# Altium project Driver_10kW.PrjPcb
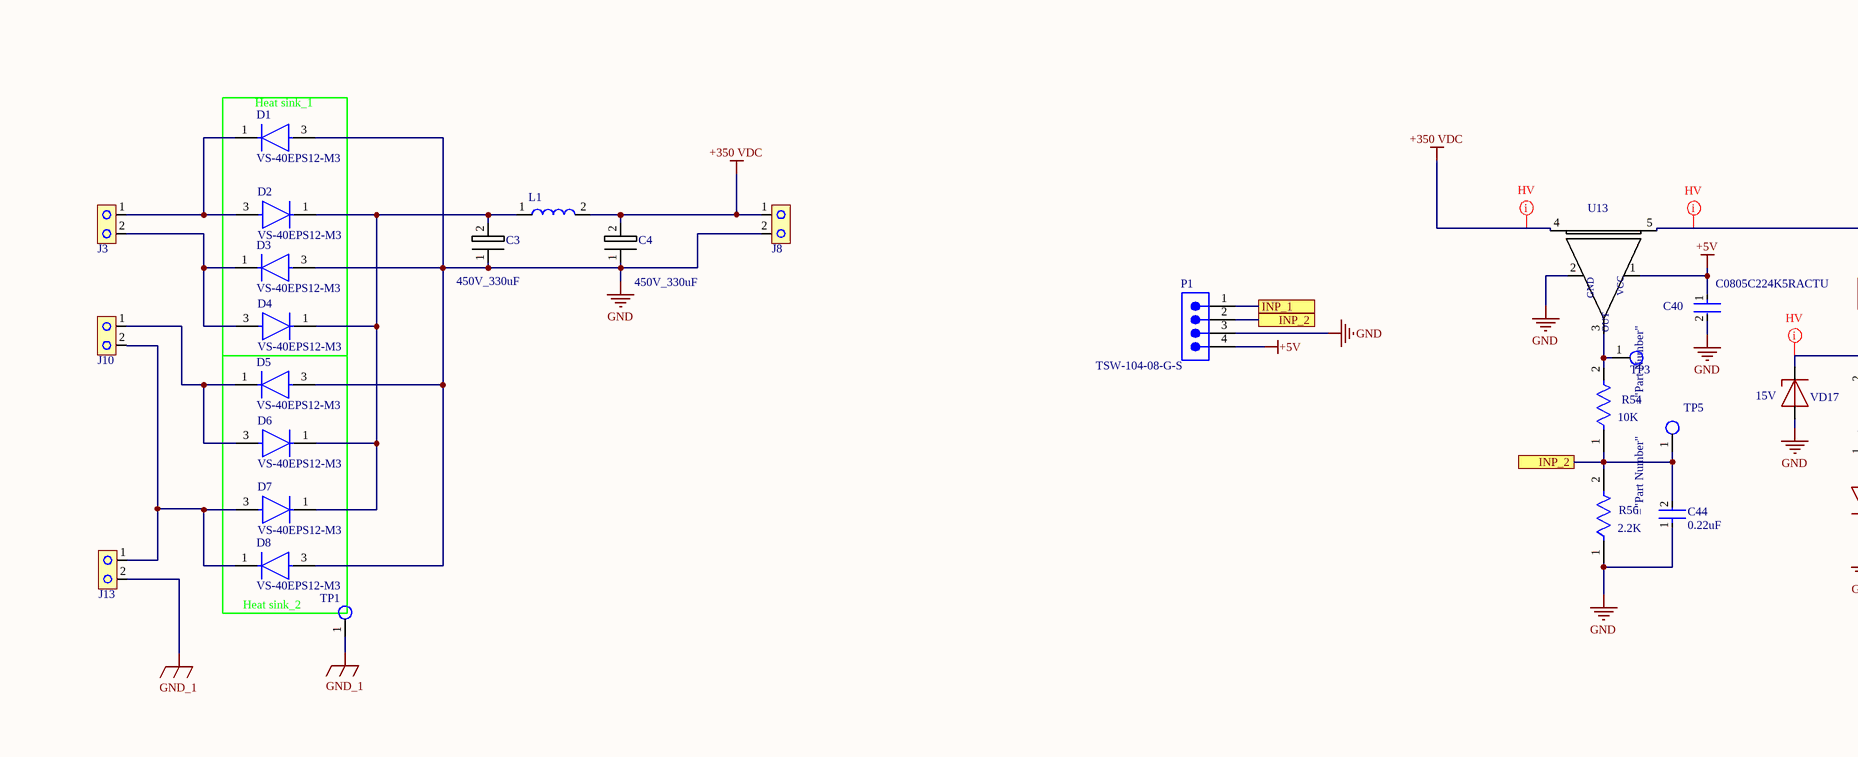
[diagram p0: Driver_10kW.SchDoc, top left]
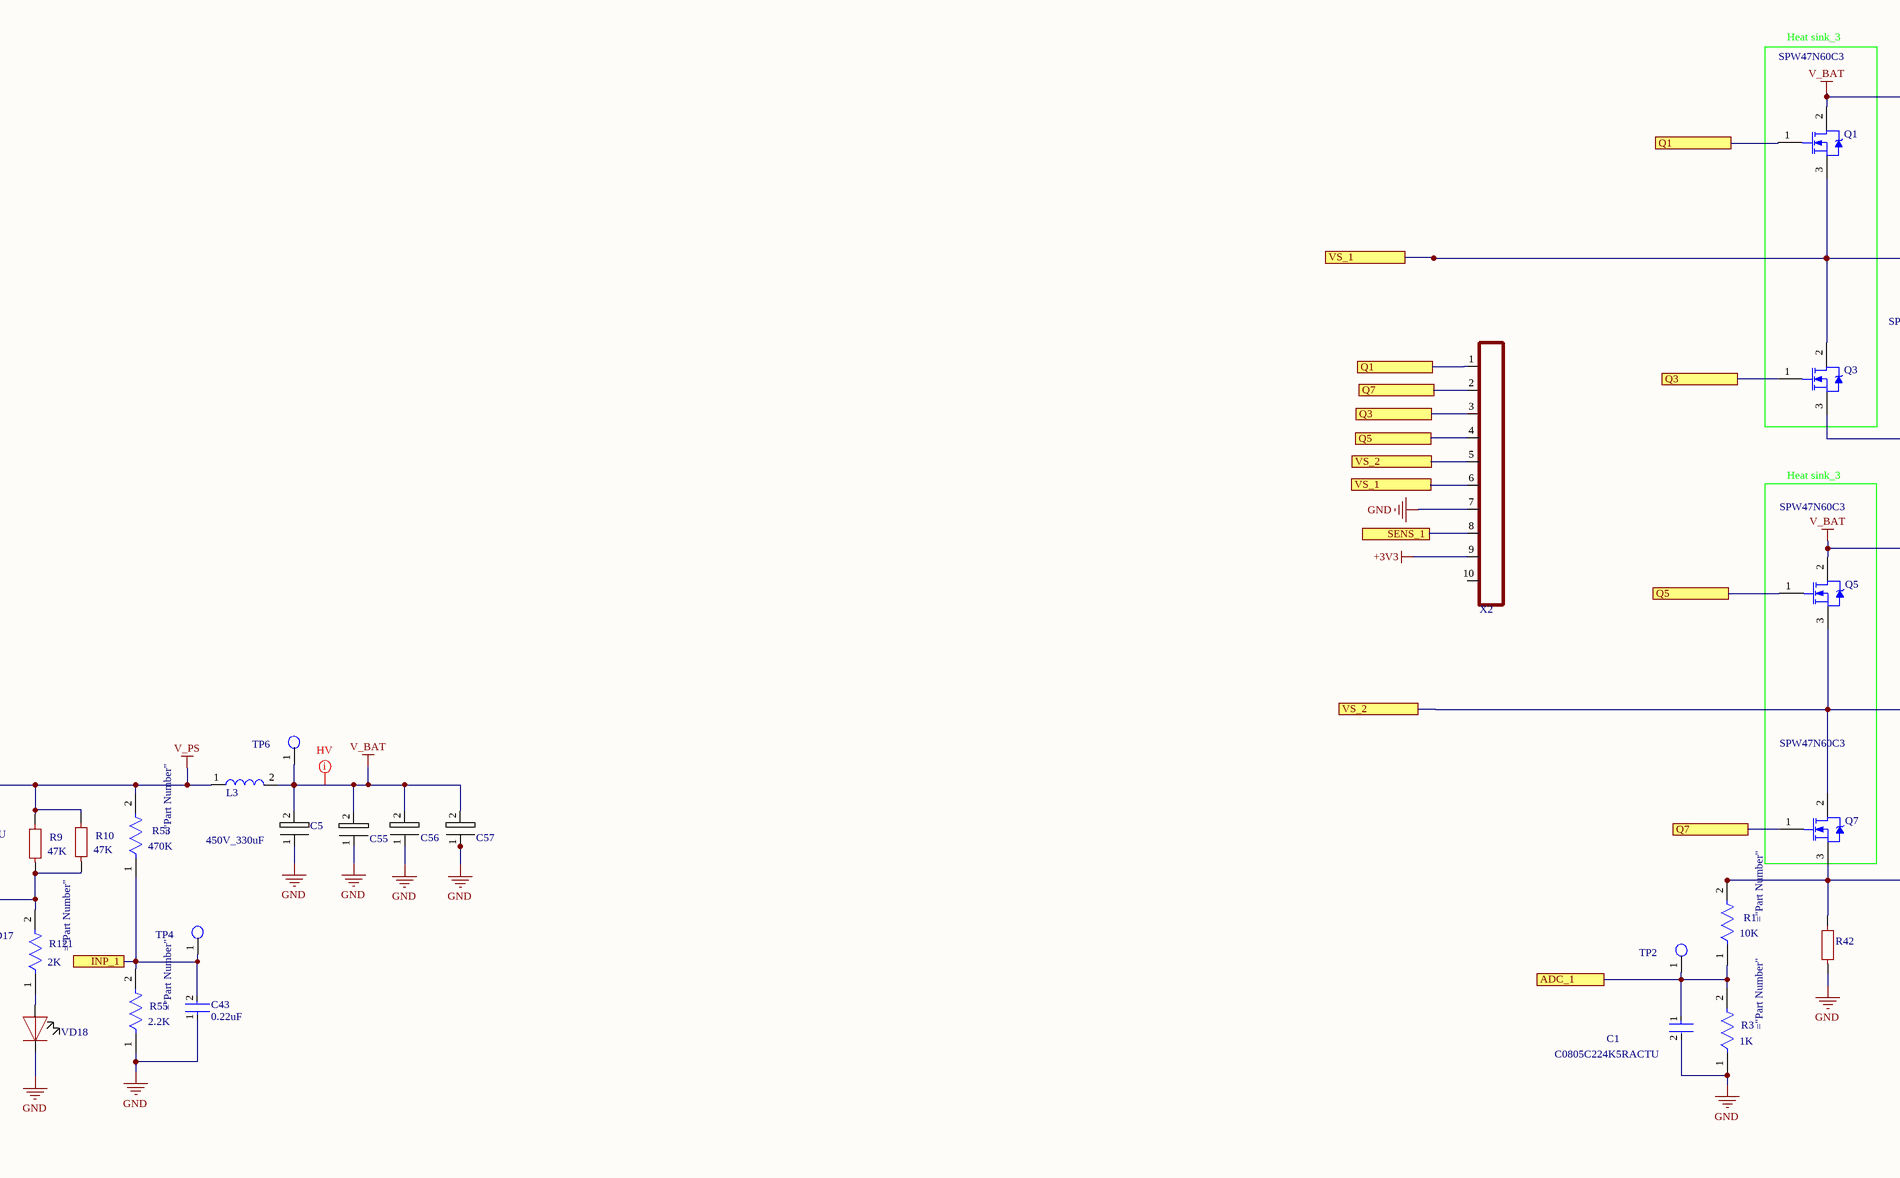
[diagram p1: Driver_10kW.SchDoc, top middle]
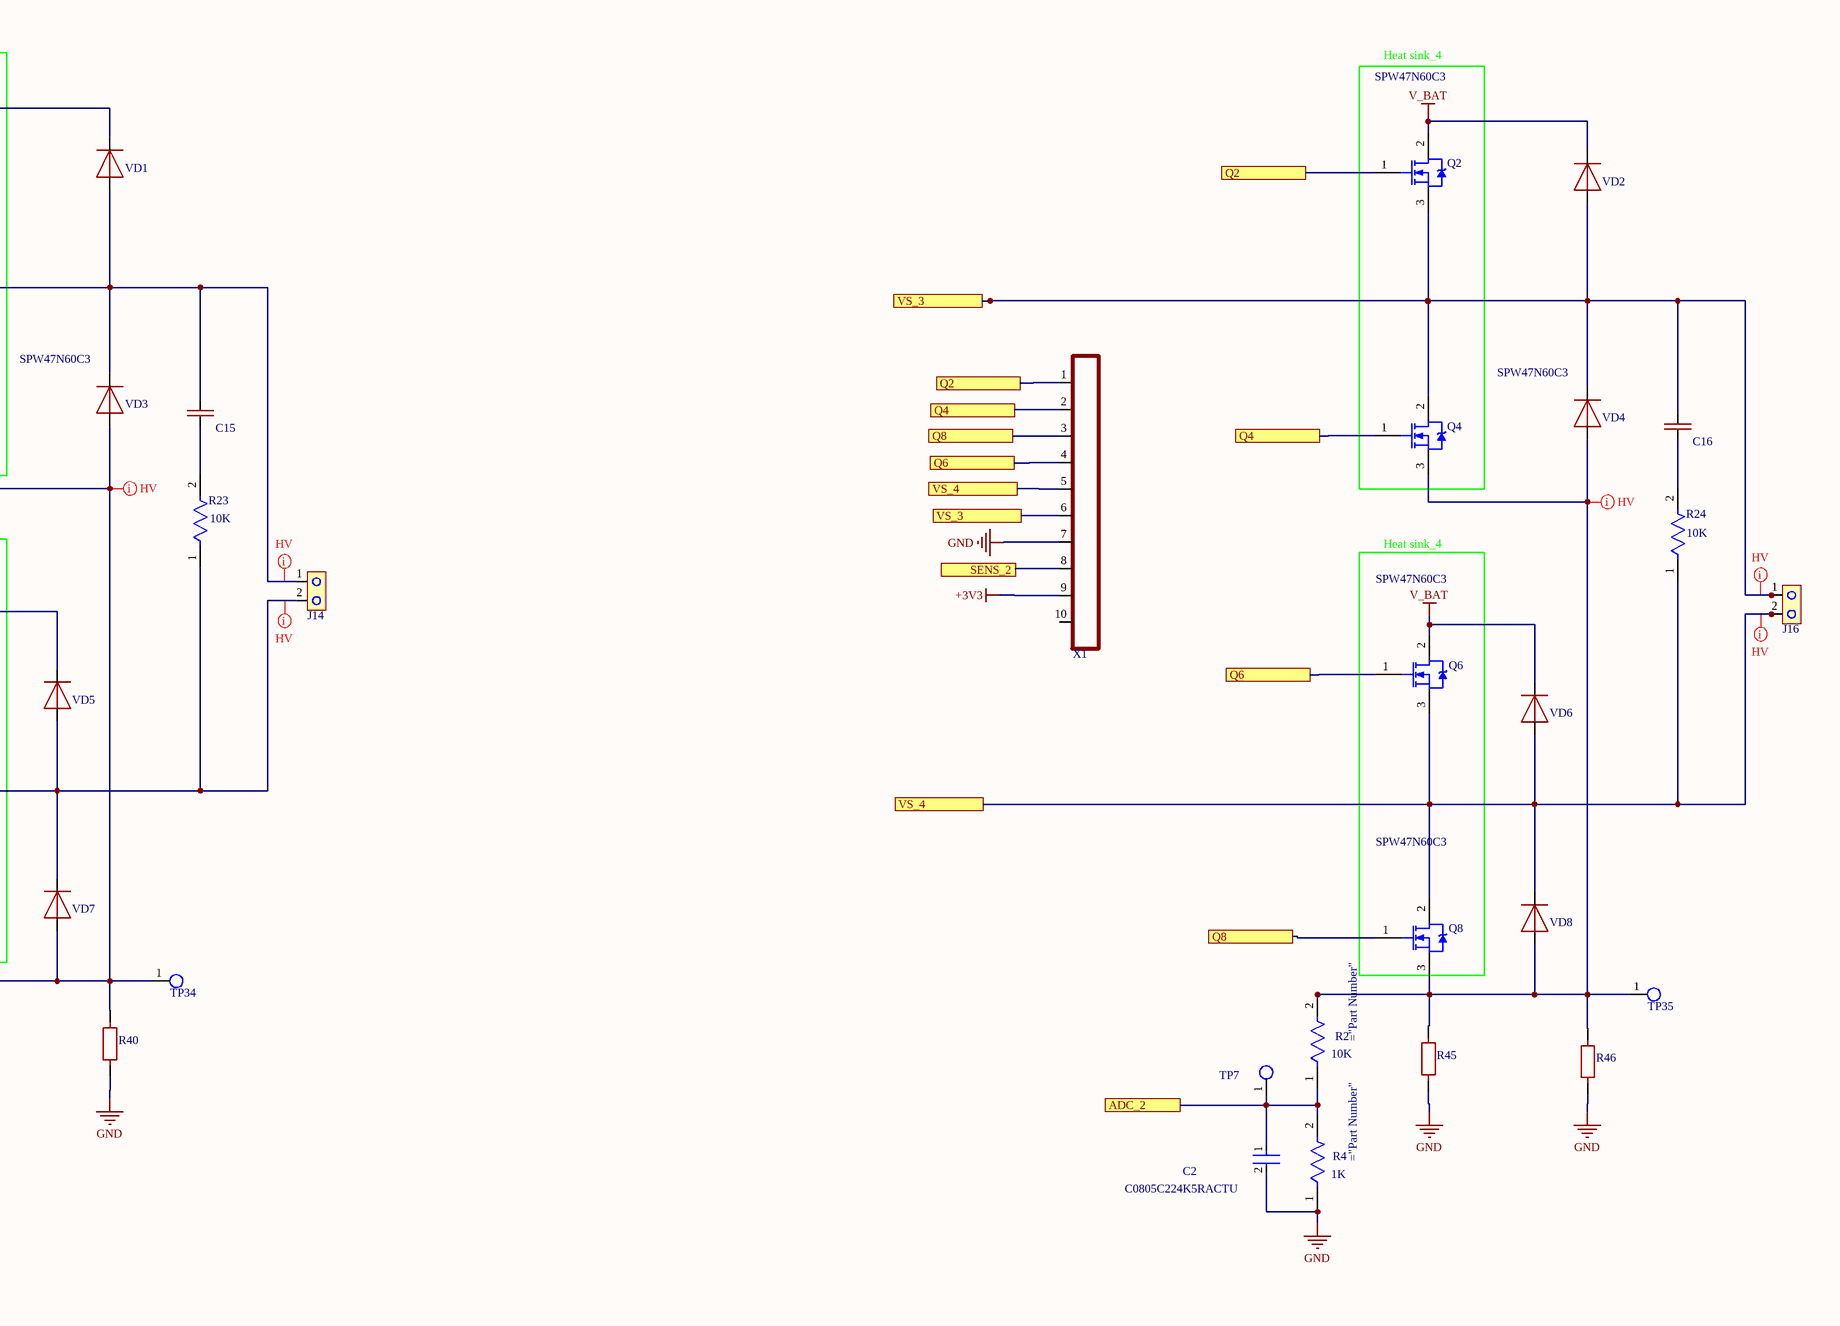
[diagram p2: Driver_10kW.SchDoc, top right]
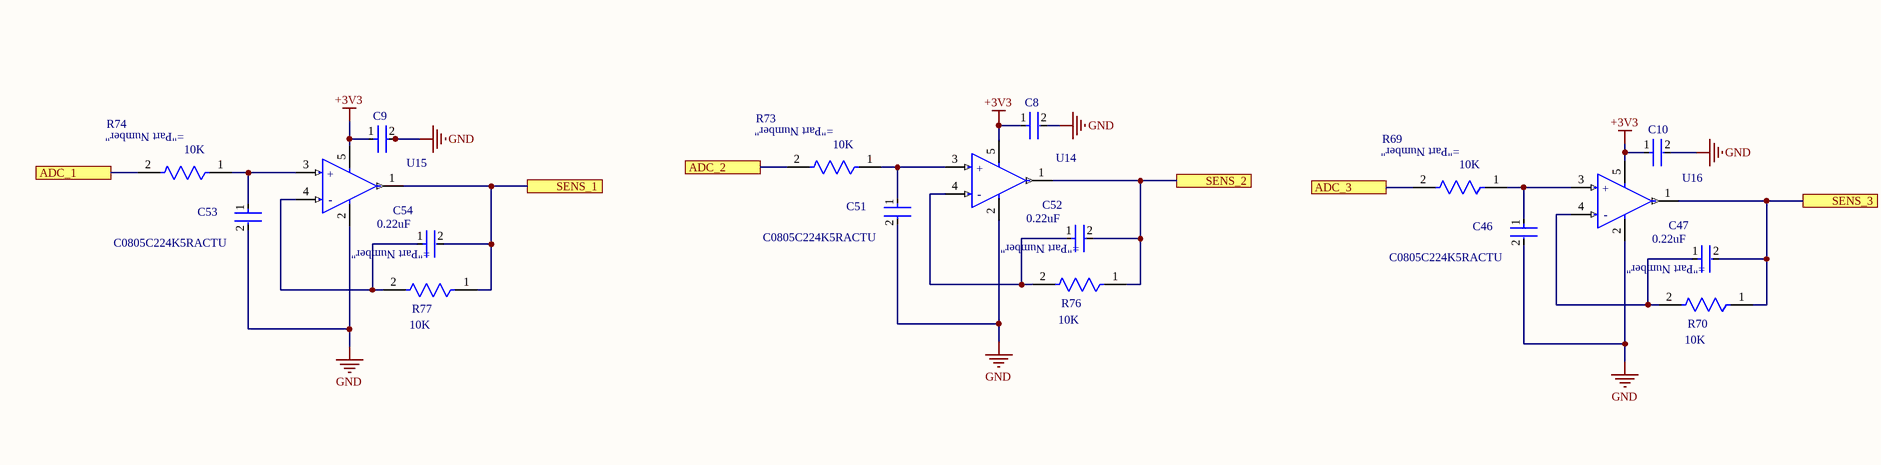
[diagram p3: Driver_10kW.SchDoc, bottom left]
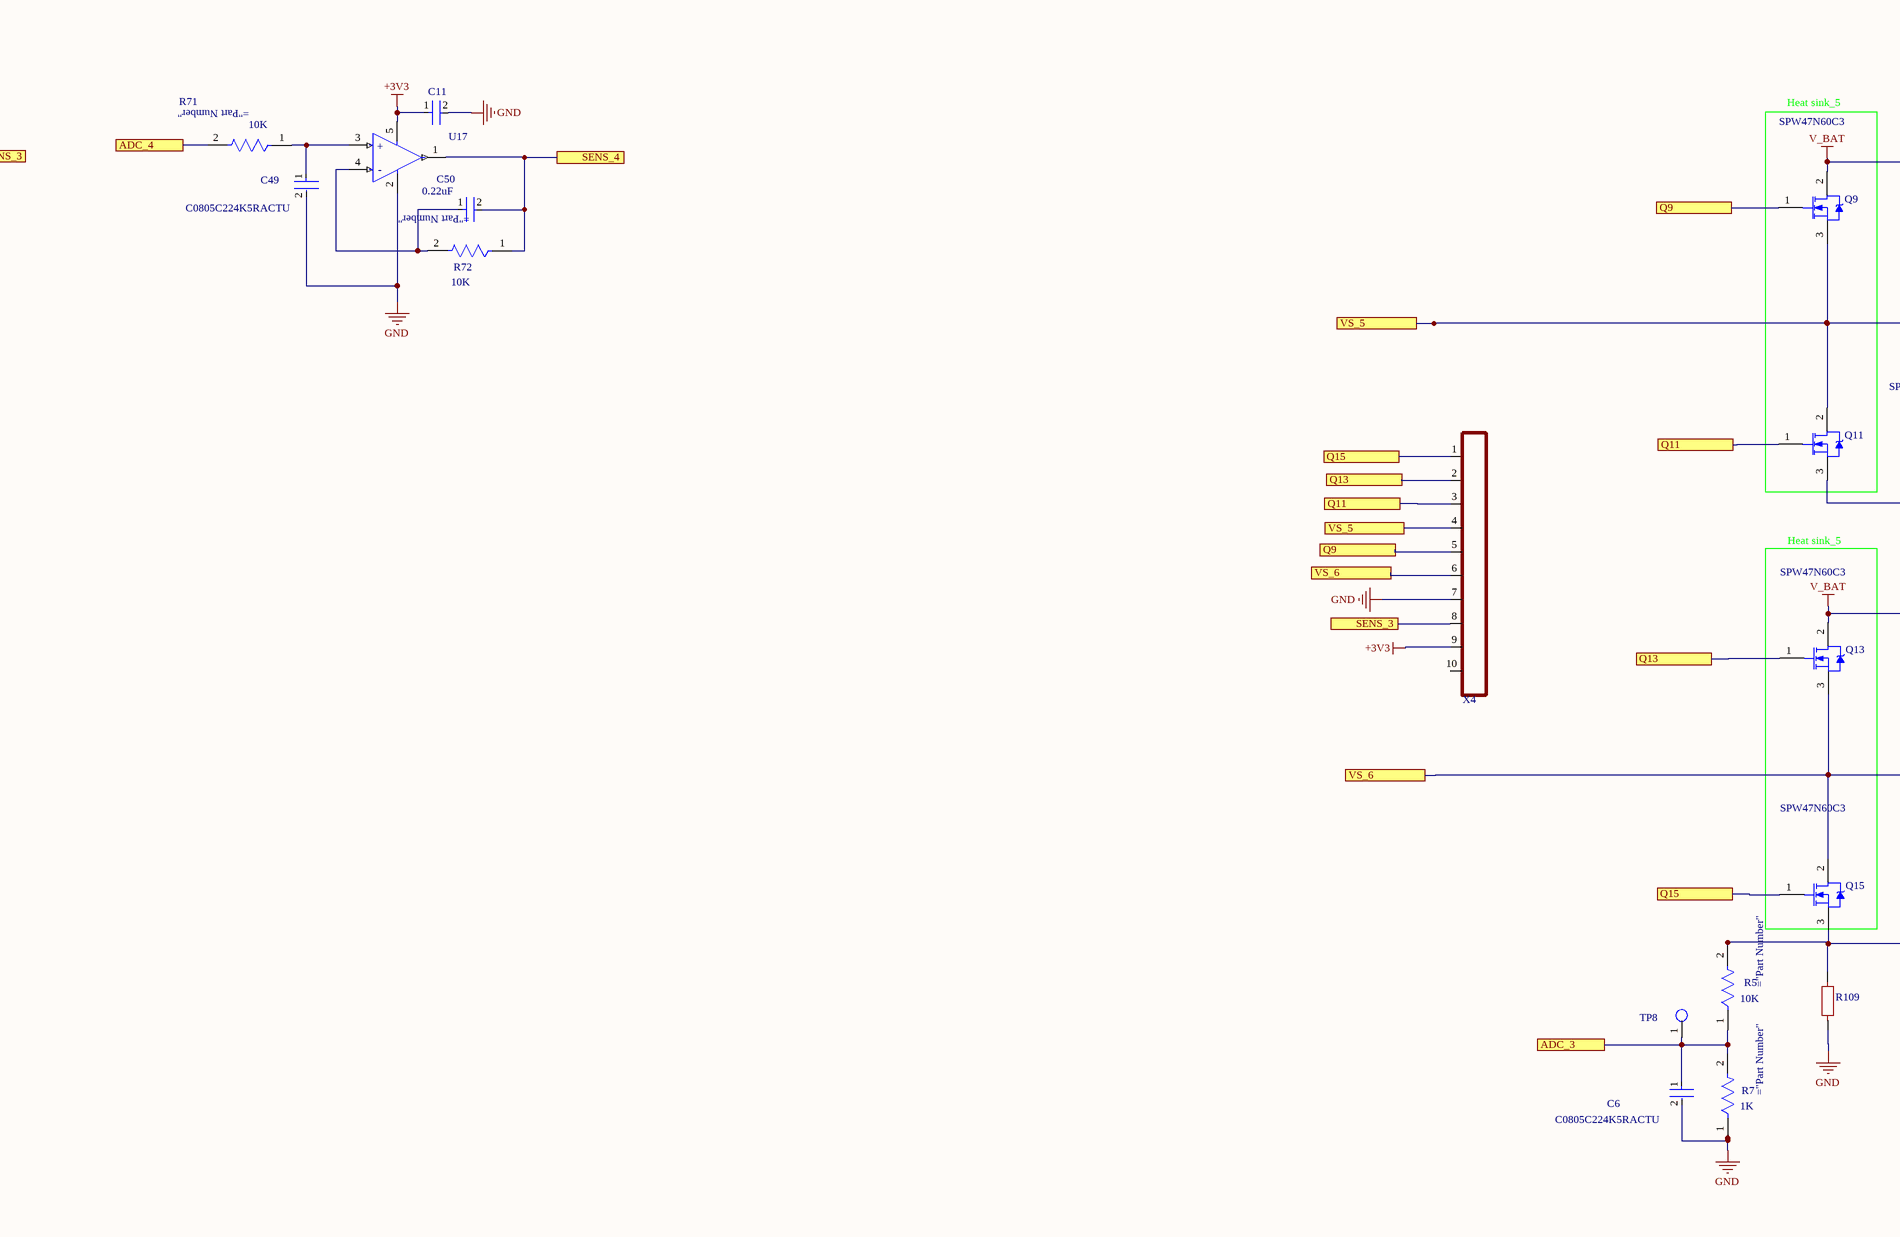
[diagram p4: Driver_10kW.SchDoc, bottom middle]
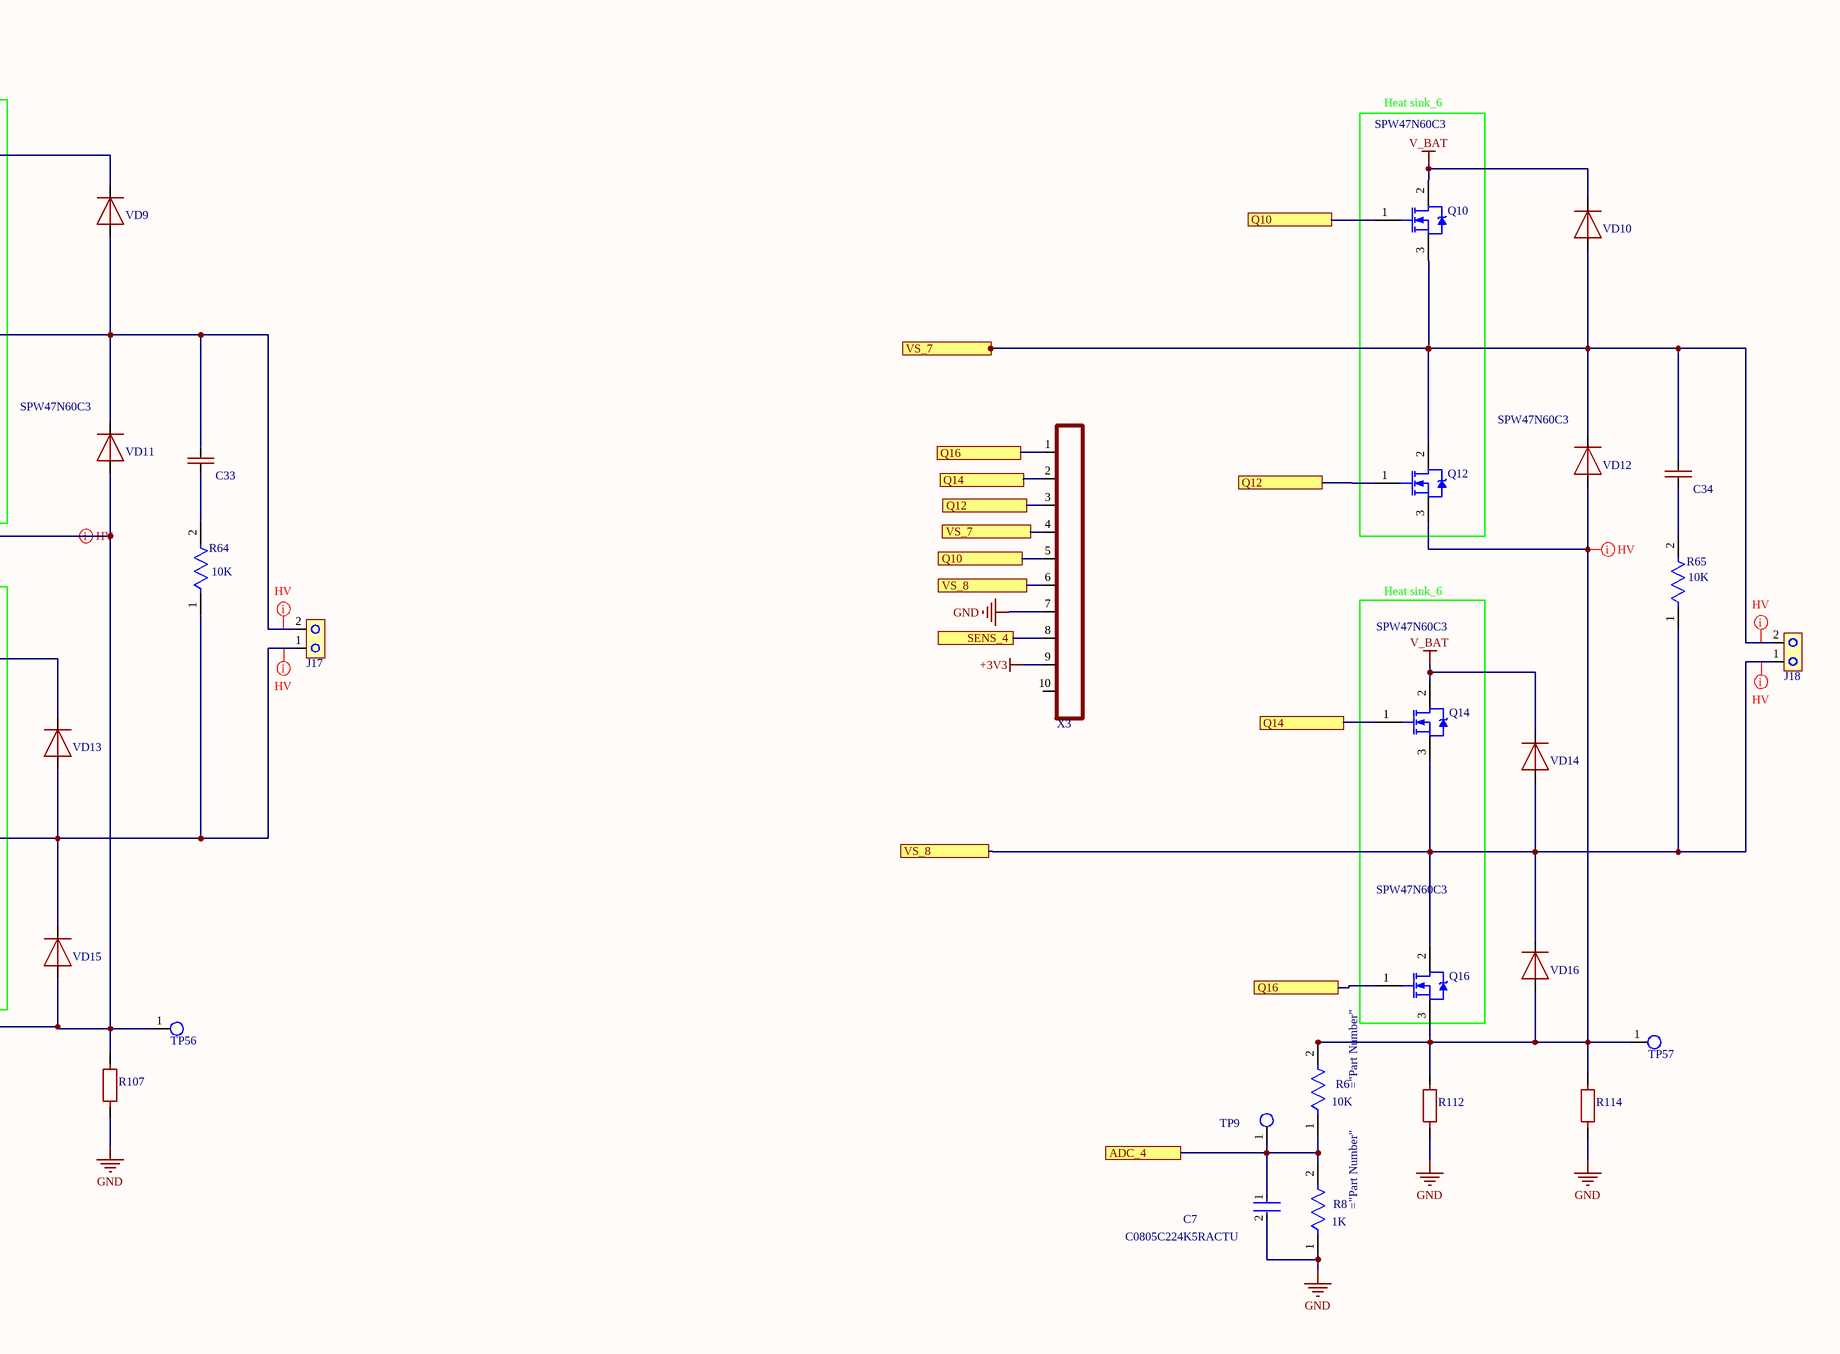
[diagram p5: Driver_10kW.SchDoc, bottom right]
1 sheet, 139 parts. Net scope: flat (ports and power ports of the same name join across sheets).
Board file: Driver_10kW.PcbDoc

## Sheet Driver_10kW.SchDoc
size 1249 x 800 mm; SheetNumber: 1; SheetTotal: 1

### Parts
C1  C0805C224K5RACTU  [FP-C0805C-DN-MFG]
C2  C0805C224K5RACTU  [FP-C0805C-DN-MFG]
C3  450V_330uF  [CAP_450V_470uF]
C4  450V_330uF  [CAP_450V_470uF]
C5  450V_330uF  [CAP_450V_470uF]
C6  C0805C224K5RACTU  [FP-C0805C-DN-MFG]
C7  C0805C224K5RACTU  [FP-C0805C-DN-MFG]
C8  C0805C224K5RACTU  [FP-C0805C-DN-MFG]  (value not drawn)
C9  C0805C224K5RACTU  [FP-C0805C-DN-MFG]  (value not drawn)
C10  C0805C224K5RACTU  [FP-C0805C-DN-MFG]  (value not drawn)
C11  C0805C224K5RACTU  [FP-C0805C-DN-MFG]  (value not drawn)
C15  CAP-NON-POLAR  [CAP-1206]  (value not drawn)
C16  CAP-NON-POLAR  [CAP-1206]  (value not drawn)
C33  CAP-NON-POLAR  [CAP-1206]  (value not drawn)
C34  CAP-NON-POLAR  [CAP-1206]  (value not drawn)
C40  C0805C224K5RACTU  [FP-C0805C-DN-MFG]
C43  0.22uF  [FP-C0805C-DN-MFG]
C44  0.22uF  [FP-C0805C-DN-MFG]
C46  C0805C224K5RACTU  [FP-C0805C-DN-MFG]
C47  0.22uF  [FP-C0805C-DN-MFG]
C49  C0805C224K5RACTU  [FP-C0805C-DN-MFG]
C50  0.22uF  [FP-C0805C-DN-MFG]
C51  C0805C224K5RACTU  [FP-C0805C-DN-MFG]
C52  0.22uF  [FP-C0805C-DN-MFG]
C53  C0805C224K5RACTU  [FP-C0805C-DN-MFG]
C54  0.22uF  [FP-C0805C-DN-MFG]
C55  450V_330uF  [CAP_450V_470uF]  (value not drawn)
C56  450V_330uF  [CAP_450V_470uF]  (value not drawn)
C57  450V_330uF  [CAP_450V_470uF]  (value not drawn)
D1  VS-40EPS12-M3  [40EPS08]
D2  VS-40EPS12-M3  [40EPS08]
D3  VS-40EPS12-M3  [40EPS08]
D4  VS-40EPS12-M3  [40EPS08]
D5  VS-40EPS12-M3  [40EPS08]
D6  VS-40EPS12-M3  [40EPS08]
D7  VS-40EPS12-M3  [40EPS08]
D8  VS-40EPS12-M3  [40EPS08]
J3  TL-800  [Conn_Tianli_T-800]  (value not drawn)
J8  TL-800  [Conn_Tianli_T-800]  (value not drawn)
J10  TL-800  [Conn_Tianli_T-800]  (value not drawn)
J13  TL-800  [Conn_Tianli_T-800]  (value not drawn)
J14  TL-800  [Conn_Tianli_T-800]  (value not drawn)
J16  TL-800  [Conn_Tianli_T-800]  (value not drawn)
J17  TL-800  [Conn_Tianli_T-800]  (value not drawn)
J18  TL-800  [Conn_Tianli_T-800]  (value not drawn)
L1  Coil  [Filtr_drossel]  (value not drawn)
L3  Coil  [Filtr_drossel]  (value not drawn)
P1  TSW-104-08-G-S  [SMTC-TSW-104-08-X-S]
Q1  SPW47N60C3  [TO-247]
Q2  SPW47N60C3  [TO-247]
Q3  SPW47N60C3  [TO-247]
Q4  SPW47N60C3  [TO-247]
Q5  SPW47N60C3  [TO-247]
Q6  SPW47N60C3  [TO-247]
Q7  SPW47N60C3  [TO-247]
Q8  SPW47N60C3  [TO-247]
Q9  SPW47N60C3  [TO-247]
Q10  SPW47N60C3  [TO-247]
Q11  SPW47N60C3  [TO-247]
Q12  SPW47N60C3  [TO-247]
Q13  SPW47N60C3  [TO-247]
Q14  SPW47N60C3  [TO-247]
Q15  SPW47N60C3  [TO-247]
Q16  SPW47N60C3  [TO-247]
R1  10K  [Yageo_RC0805_IPC_C]
R2  10K  [Yageo_RC0805_IPC_C]
R3  1K  [Yageo_RC0805_IPC_A]
R4  1K  [Yageo_RC0805_IPC_A]
R5  10K  [Yageo_RC0805_IPC_C]
R6  10K  [Yageo_RC0805_IPC_C]
R7  1K  [Yageo_RC0805_IPC_A]
R8  1K  [Yageo_RC0805_IPC_A]
R9  47K  [RES-2512]
R10  47K  [RES-2512]
R23  10K  [FP-CRCW1210-e3-IPC_A]
R24  10K  [FP-CRCW1210-e3-IPC_A]
R40  RES-CONST  [RES-3921]  (value not drawn)
R42  RES-CONST  [RES-3921]  (value not drawn)
R45  RES-CONST  [RES-3921]  (value not drawn)
R46  RES-CONST  [RES-3921]  (value not drawn)
R53  470K  [Vishay_CRCW0805-e3_IPC_A]
R54  10K  [Vishay_CRCW0805-e3_IPC_A]
R55  2.2K  [Vishay_CRCW0805-e3_IPC_A]
R56  2.2K  [Vishay_CRCW0805-e3_IPC_A]
R64  10K  [FP-CRCW1210-e3-IPC_A]
R65  10K  [FP-CRCW1210-e3-IPC_A]
R69  10K  [Yageo_RC0805_IPC_C]
R70  10K  [Yageo_RC0805_IPC_C]
R71  10K  [Yageo_RC0805_IPC_C]
R72  10K  [Yageo_RC0805_IPC_C]
R73  10K  [Yageo_RC0805_IPC_C]
R74  10K  [Yageo_RC0805_IPC_C]
R76  10K  [Yageo_RC0805_IPC_C]
R77  10K  [Yageo_RC0805_IPC_C]
R107  RES-CONST  [RES-3921]  (value not drawn)
R109  RES-CONST  [RES-3921]  (value not drawn)
R112  RES-CONST  [RES-3921]  (value not drawn)
R114  RES-CONST  [RES-3921]  (value not drawn)
R121  2K  [Yageo_RC0805_IPC_A]
TP1  Test_Point_PCB  [Test_Point]  (value not drawn)
TP2  Test_Point_PCB  [Test_Point]  (value not drawn)
TP3  Test_Point_PCB  [Test_Point]  (value not drawn)
TP4  Test_Point_PCB  [Test_Point]  (value not drawn)
TP5  Test_Point_PCB  [Test_Point]  (value not drawn)
TP6  Test_Point_PCB  [Test_Point]  (value not drawn)
TP7  Test_Point_PCB  [Test_Point]  (value not drawn)
TP8  Test_Point_PCB  [Test_Point]  (value not drawn)
TP9  Test_Point_PCB  [Test_Point]  (value not drawn)
TP34  Test_Point_PCB  [Test_Point]  (value not drawn)
TP35  Test_Point_PCB  [Test_Point]  (value not drawn)
TP56  Test_Point_PCB  [Test_Point]  (value not drawn)
TP57  Test_Point_PCB  [Test_Point]  (value not drawn)
U13  ACS758  [ACS758-100]  (value not drawn)
U14  MCP6001  [SOT-23-5]  (value not drawn)
U15  MCP6001  [SOT-23-5]  (value not drawn)
U16  MCP6001  [SOT-23-5]  (value not drawn)
U17  MCP6001  [SOT-23-5]  (value not drawn)
VD1  DIODE  [DO-214AB]  (value not drawn)
VD2  DIODE  [DO-214AB]  (value not drawn)
VD3  DIODE  [DO-214AB]  (value not drawn)
VD4  DIODE  [DO-214AB]  (value not drawn)
VD5  DIODE  [DO-214AB]  (value not drawn)
VD6  DIODE  [DO-214AB]  (value not drawn)
VD7  DIODE  [DO-214AB]  (value not drawn)
VD8  DIODE  [DO-214AB]  (value not drawn)
VD9  DIODE  [DO-214AB]  (value not drawn)
VD10  DIODE  [DO-214AB]  (value not drawn)
VD11  DIODE  [DO-214AB]  (value not drawn)
VD12  DIODE  [DO-214AB]  (value not drawn)
VD13  DIODE  [DO-214AB]  (value not drawn)
VD14  DIODE  [DO-214AB]  (value not drawn)
VD15  DIODE  [DO-214AB]  (value not drawn)
VD16  DIODE  [DO-214AB]  (value not drawn)
VD17  15V  [DO-017AA]
VD18  LED  [LED-0603]  (value not drawn)
X1  BH-10  [BH-10]  (value not drawn)
X2  BH-10  [BH-10]  (value not drawn)
X3  BH-10  [BH-10]  (value not drawn)
X4  BH-10  [BH-10]  (value not drawn)

### Blocks framed on the sheet
Heat sink_3: Q1 Q3
Heat sink_4: Q2 Q4
Heat sink_3: Q5 Q7
Heat sink_4: Q6 Q8
Heat sink_1: D1-D4
Heat sink_2: D5-D8
Heat sink_5: Q9 Q11
Heat sink_6: Q10 Q12
Heat sink_5: Q13 Q15
Heat sink_6: Q14 Q16

### Ports
ADC_1, ADC_2, ADC_3, ADC_4, INP_1, INP_2, Q1, Q2, Q3, Q4, Q5, Q6, Q7, Q8, Q9, Q10, Q11, Q12, Q13, Q14, Q15, Q16, SENS_1, SENS_2, SENS_3, SENS_4, VS_1, VS_2, VS_3, VS_4, VS_5, VS_6, VS_7, VS_8

### Nets
+3V3: C8.1 C9.1 C10.1 C11.1 U14.5(VDD) U15.5(VDD) U16.5(VDD) U17.5(VDD) X1.9 X2.9 X3.9 X4.9
+5V: C40.1 P1.4 U13.1(+VCC)
+350 VDC: C4.2 J8.1 L1.2 U13.4(+IP)
GND: C1.2 C2.2 C3.1 C4.1 C5.1 C6.2 C7.2 C8.2 C9.2 C10.2 C11.2 C40.2 C43.1 C44.1 C46.2 C49.2 C51.2 C53.2 C55.1 C56.1 C57.1 D1.3(A) D3.3(A) D5.3(A) D8.3(A) J8.2 P1.3 R3.1 R4.1 R7.1 R8.1 R40.1 R42.1 R45.1 R46.1 R55.1 R56.1 R107.1 R109.1 R112.1 R114.1 U13.2(GND) U14.2(VSS) U15.2(VSS) U16.2(VSS) U17.2(VSS) VD17.2(A) VD18.1(C) X1.7 X2.7 X3.7 X4.7
GND_1: J13.2 TP1.1(G9)
V_BAT: C5.2 C55.2 C56.2 C57.2 L3.2 Q1.2(DRAIN) Q2.2(DRAIN) Q5.2(DRAIN) Q6.2(DRAIN) Q9.2(DRAIN) Q10.2(DRAIN) Q13.2(DRAIN) Q14.2(DRAIN) TP6.1(G9) VD1.1(C) VD2.1(C) VD5.1(C) VD6.1(C) VD9.1(C) VD10.1(C) VD13.1(C) VD14.1(C)
V_PS: L3.1 R9.2 R10.2 R53.2 U13.5(-IP)
NetC1_1: C1.1 R1.1 R3.2 R74.2 TP2.1(G9) ; port ADC_1
NetC2_1: C2.1 R2.1 R4.2 R73.2 TP7.1(G9) ; port ADC_2
NetC3_2: C3.2 D2.1(C) D4.1(C) D6.1(C) D7.1(C) L1.1
NetC6_1: C6.1 R5.1 R7.2 R69.2 TP8.1(G9) ; port ADC_3
NetC7_1: C7.1 R6.1 R8.2 R71.2 TP9.1(G9) ; port ADC_4
NetC15_1: C15.1 R23.2
NetC15_2: C15.2 J14.1 Q1.3(SOURCE) Q3.2(DRAIN) VD1.2(A) VD3.1(C) X2.6 ; port VS_1
NetC16_1: C16.1 R24.2
NetC16_2: C16.2 J16.1 Q2.3(SOURCE) Q4.2(DRAIN) VD2.2(A) VD4.1(C) X1.6 ; port VS_3
NetC33_1: C33.1 R64.2
NetC33_2: C33.2 J17.2 Q9.3(SOURCE) Q11.2(DRAIN) VD9.2(A) VD11.1(C) X4.4 ; port VS_5
NetC34_1: C34.1 R65.2
NetC34_2: C34.2 J18.2 Q10.3(SOURCE) Q12.2(DRAIN) VD10.2(A) VD12.1(C) X3.4 ; port VS_7
NetC43_2: C43.2 P1.1 R53.1 R55.2 TP4.1(G9) ; port INP_1
NetC44_2: C44.2 P1.2 R54.1 R56.2 TP5.1(G9) ; port INP_2
NetC46_1: C46.1 R69.1 U16.3(VIN+)
NetC47_1: C47.1 R70.2 U16.4(VIN-)
NetC47_2: C47.2 R70.1 U16.1(VOUT) X4.8 ; port SENS_3
NetC49_1: C49.1 R71.1 U17.3(VIN+)
NetC50_1: C50.1 R72.2 U17.4(VIN-)
NetC50_2: C50.2 R72.1 U17.1(VOUT) X3.8 ; port SENS_4
NetC51_1: C51.1 R73.1 U14.3(VIN+)
NetC52_1: C52.1 R76.2 U14.4(VIN-)
NetC52_2: C52.2 R76.1 U14.1(VOUT) X1.8 ; port SENS_2
NetC53_1: C53.1 R74.1 U15.3(VIN+)
NetC54_1: C54.1 R77.2 U15.4(VIN-)
NetC54_2: C54.2 R77.1 U15.1(VOUT) X2.8 ; port SENS_1
NetD1_1: D1.1(C) D2.3(A) J3.1
NetD3_1: D3.1(C) D4.3(A) J3.2
NetD5_1: D5.1(C) D6.3(A) J10.1
NetD7_3: D7.3(A) D8.1(C) J10.2 J13.1
NetJ14_2: J14.2 Q5.3(SOURCE) Q7.2(DRAIN) R23.1 VD5.2(A) VD7.1(C) X2.5 ; port VS_2
NetJ16_2: J16.2 Q6.3(SOURCE) Q8.2(DRAIN) R24.1 VD6.2(A) VD8.1(C) X1.5 ; port VS_4
NetJ17_1: J17.1 Q13.3(SOURCE) Q15.2(DRAIN) R64.1 VD13.2(A) VD15.1(C) X4.6 ; port VS_6
NetJ18_1: J18.1 Q14.3(SOURCE) Q16.2(DRAIN) R65.1 VD14.2(A) VD16.1(C) X3.6 ; port VS_8
NetQ1_1: Q1.1(GATE) X2.1 ; port Q1
NetQ2_1: Q2.1(GATE) X1.1 ; port Q2
NetQ3_1: Q3.1(GATE) X2.3 ; port Q3
NetQ3_3: Q3.3(SOURCE) Q7.3(SOURCE) R1.2 R40.2 R42.2 TP34.1(G9) VD3.2(A) VD7.2(A)
NetQ4_1: Q4.1(GATE) X1.2 ; port Q4
NetQ4_3: Q4.3(SOURCE) Q8.3(SOURCE) R2.2 R45.2 R46.2 TP35.1(G9) VD4.2(A) VD8.2(A)
NetQ5_1: Q5.1(GATE) X2.4 ; port Q5
NetQ6_1: Q6.1(GATE) X1.4 ; port Q6
NetQ7_1: Q7.1(GATE) X2.2 ; port Q7
NetQ8_1: Q8.1(GATE) X1.3 ; port Q8
NetQ9_1: Q9.1(GATE) X4.5 ; port Q9
NetQ10_1: Q10.1(GATE) X3.5 ; port Q10
NetQ11_1: Q11.1(GATE) X4.3 ; port Q11
NetQ11_3: Q11.3(SOURCE) Q15.3(SOURCE) R5.2 R107.2 R109.2 TP56.1(G9) VD11.2(A) VD15.2(A)
NetQ12_1: Q12.1(GATE) X3.3 ; port Q12
NetQ12_3: Q12.3(SOURCE) Q16.3(SOURCE) R6.2 R112.2 R114.2 TP57.1(G9) VD12.2(A) VD16.2(A)
NetQ13_1: Q13.1(GATE) X4.2 ; port Q13
NetQ14_1: Q14.1(GATE) X3.2 ; port Q14
NetQ15_1: Q15.1(GATE) X4.1 ; port Q15
NetQ16_1: Q16.1(GATE) X3.1 ; port Q16
NetR9_1: R9.1 R10.1 R121.2 VD17.1(C)
NetR54_2: R54.2 TP3.1(G9) U13.3(OUT)
NetR121_1: R121.1 VD18.2(A)

Not connected (* = marked no-connect by the designer): X1 10; X2 10; X3 10; X4 10

### Layout directives
net class HV: +350 VDC, NetC15_2, NetC16_2, NetC33_2, NetC34_2, NetJ14_2, NetJ16_2, NetJ17_1, NetJ18_1, NetQ3_3, NetQ4_3, NetQ11_3, NetQ12_3, NetR9_1, V_BAT, V_PS

### Notes on the sheet
- (in symbol ACS758) VCC
- (in symbol MCP6001T) +; -

### Library data of the parts
C1 C2 C6-C11 C40 C46 C49 C51 C53 = CMP-1036-04552-2: CAP CER 0.22UF 50V X7R 0805; Manufacturer: KEMET; Value: 0.22 μF; Temperature Coefficient: 30ppm/°C; Material: Ceramic; Tolerance: 0.1; ComponentLink2URL: https://content.kemet.com/datasheets/KEM_C1003_C0G_SMD.pdf; Temperature Characteristic: X7R; Device Class L3: Ceramic Capacitors; Lead Free: Yes; Temperature: -55°C to +125°C; RoHS: TRUE; Capacitance: 0.22 μF; Automotive: No; Octopart: https://octopart.com/c0805c224k5ractu-kemet-144670; Manufacturer Part Number: C0805C224K5RACTU; Temperature Range Low: -55°C; Height: 0.88mm; Device Class L1: Passive Components; Digikey Description: CAP CER 0.22UF 50V X7R 0805; ComponentLink2Description: Datasheet; Mouser Description: CAP CER 0.22UF 50V X7R 0805; Category: Cap; Ipc Land Pattern Name: CAPC200125X78; Temperature Range High: +125°C; Package: C0805C-DN; Device Class L2: Capacitors; Voltage Rating: 50 V
C3-C5 C55-C57 = CAP_450V_330uF
C43 C44 C47 C50 C52 C54 = CMP-1036-04552-2: CAP CER 0.22UF 50V X7R 0805; Manufacturer: KEMET; Manufacturer Part Number: C0805C224K5RACTU; Value: 0.22 μF; Temperature Coefficient: 30ppm/°C; Material: Ceramic; Tolerance: 0.1; ComponentLink2URL: https://content.kemet.com/datasheets/KEM_C1003_C0G_SMD.pdf; Temperature Characteristic: X7R; Device Class L3: Ceramic Capacitors; Lead Free: Yes; Temperature: -55°C to +125°C; RoHS: TRUE; Capacitance: 0.22 μF; Automotive: No; Octopart: https://octopart.com/c0805c224k5ractu-kemet-144670; Temperature Range Low: -55°C; Height: 0.88mm; Device Class L1: Passive Components; Digikey Description: CAP CER 0.22UF 50V X7R 0805; ComponentLink2Description: Datasheet; Mouser Description: CAP CER 0.22UF 50V X7R 0805; Category: Cap; Ipc Land Pattern Name: CAPC200125X78; Temperature Range High: +125°C; Package: C0805C-DN; Device Class L2: Capacitors; Voltage Rating: 50 V
D1-D8 = VS-40EPS12: DIODE GP 1.2KV 40A TO247AC; Series: -; Case/Package: TO-247-2; Mount: Through Hole; Max Reverse Voltage (DC): 1.2kV; RoHS Compliant: Yes; Packaging: Rail/Tube; Average Rectified Current: 40A
J3 J8 J10 J13 J14 J16-J18 = Connector_Tianli_T-800
P1 = CMP-1024-00357-1: 0.025" SQ Post Header, Through-hole, Vertical, -55 to 125 degC, 2.54 mm Pitch, 4-Pin, Male, RoHS; Manufacturer: Samtec; Pitch: 2.54 mm; RoHS: True; ComponentLink3URL: http://www.samtec.com/documents/webfiles/cpdf/TSW-XXX-XX-XXX-X-XX-XXX-MKT.pdf; Mounting Technology: Through-hole; ComponentLink2URL: http://www.samtec.com/documents/webfiles/pdf/TSW_TH.PDF; ComponentLink1URL: http://www.samtec.com; ComponentLink3Description: Package Specification; PackageVersion: DM, 8/1988; ComponentLink2Description: Datasheet; PackageReference: TSW-104-08-X-S; PackageDescription: .025[0.64] SQ. Post Terminal Strip Assembly; PartNumber: TSW-104-08-G-S; ComponentLink1Description: Manufacturer URL; Temperature Range: -55 to 125 degC; DatasheetVersion: F-214; Orientation: Vertical
Q1-Q16 = SPW47N60C3: N-Channel CoolMOS Power-Transistor, 600 V VDS, 47 A ID, -55 to 150 degC, PG-TO247-3-44, Tube, Green; Manufacturer: Infineon; Polarity: N; Ptot (max): 415Â W; Rth: 0.3Â K/W; VGS(th) (min): 2.1Â V; ID (max): 47Â A; RthJA (max): 62Â K/W; VGS(th) (max): 3.9Â V; Green: TRUE; VDS (max): 600Â V; RDS (on) (max): 70Â mOhm; IDpuls (max): 141Â A; QG: 252Â nC; ComponentLink1Description: Manufacturer URL; Mounting Technology: Through Hole; ComponentLink1URL: http://www.infineon.com/; Technology: CoolMOS C3; PackageDescription: 3-Pin Plastic (Green) Transistor Single Outline Package, 15.94 x 20.95 mm Body, 5.44 mm Pitch; DatasheetVersion: Rev. 2.6; ComponentLink3Description: Package Specification; PackageReference: PG-TO247-3-44; Halogen-free: available; ComponentLink3URL: http://www.infineon.com/cms/packages/Leaded_and_through-hole/P-PG-TO247/P-PG-TO247-3-44.html?__locale=en; ComponentLink2URL: http://www.infineon.com/dgdl/SPW47N60C3_Rev%5B1%5D.2.6_PCN.pdf?folderId=db3a304412b407950112b408e8c90004&fileId=db3a304412b407950112b42dff93492f; PartNumber: SPW47N60C3; RthJC (max): 0.3Â K/W; Packing: Tube; PackageVersion: Rev. 03; ComponentLink2Description: Datasheet
R1-R8 R53-R56 R69-R74 R76 R77 = RC0805FR-07100KL
R9 R10 = RES-CONST
R23 R24 R64 R65 = CMP-2005-01987-2: RES SMD 10K OHM 1% 1/2W 1992; Resistance: 0mR; Temperature Coefficient: 0ppm/°C; Max Power Dissipation: 500mW; Voltage Rating: 200V; Packaging: Tape and Reel; Max Operating Temperature: 155°C; REACH SVHC: No SVHC; Min Operating Temperature: -55°C; Package Quantity: 1; Length: 3.2mm; Case Code (Metric): 3225; Case/Package: 1210; Composition: Thick Film; Military Standard: Not; Contact Plating: Tin; Case Code (Imperial): 1210; Radiation Hardening: No; Depth: 2.5mm; Termination: SMD/SMT; Features: Automotive AEC-Q200; Width: 0.098inch; Mount: Surface Mount; Power Rating: 500mW; Weight: 0.000564oz; Number of Terminations: 2; Height: 0.55mm
R121 = RC0805FR-07100KL: 220
TP1-TP9 TP34 TP35 TP56 TP57 = TP_PCB?: Test_Point
U14-U17 = MCP6001T
VD17 = ZENER